# EAGLE schematic DigitalSandbox (EAGLE 6.5.0)
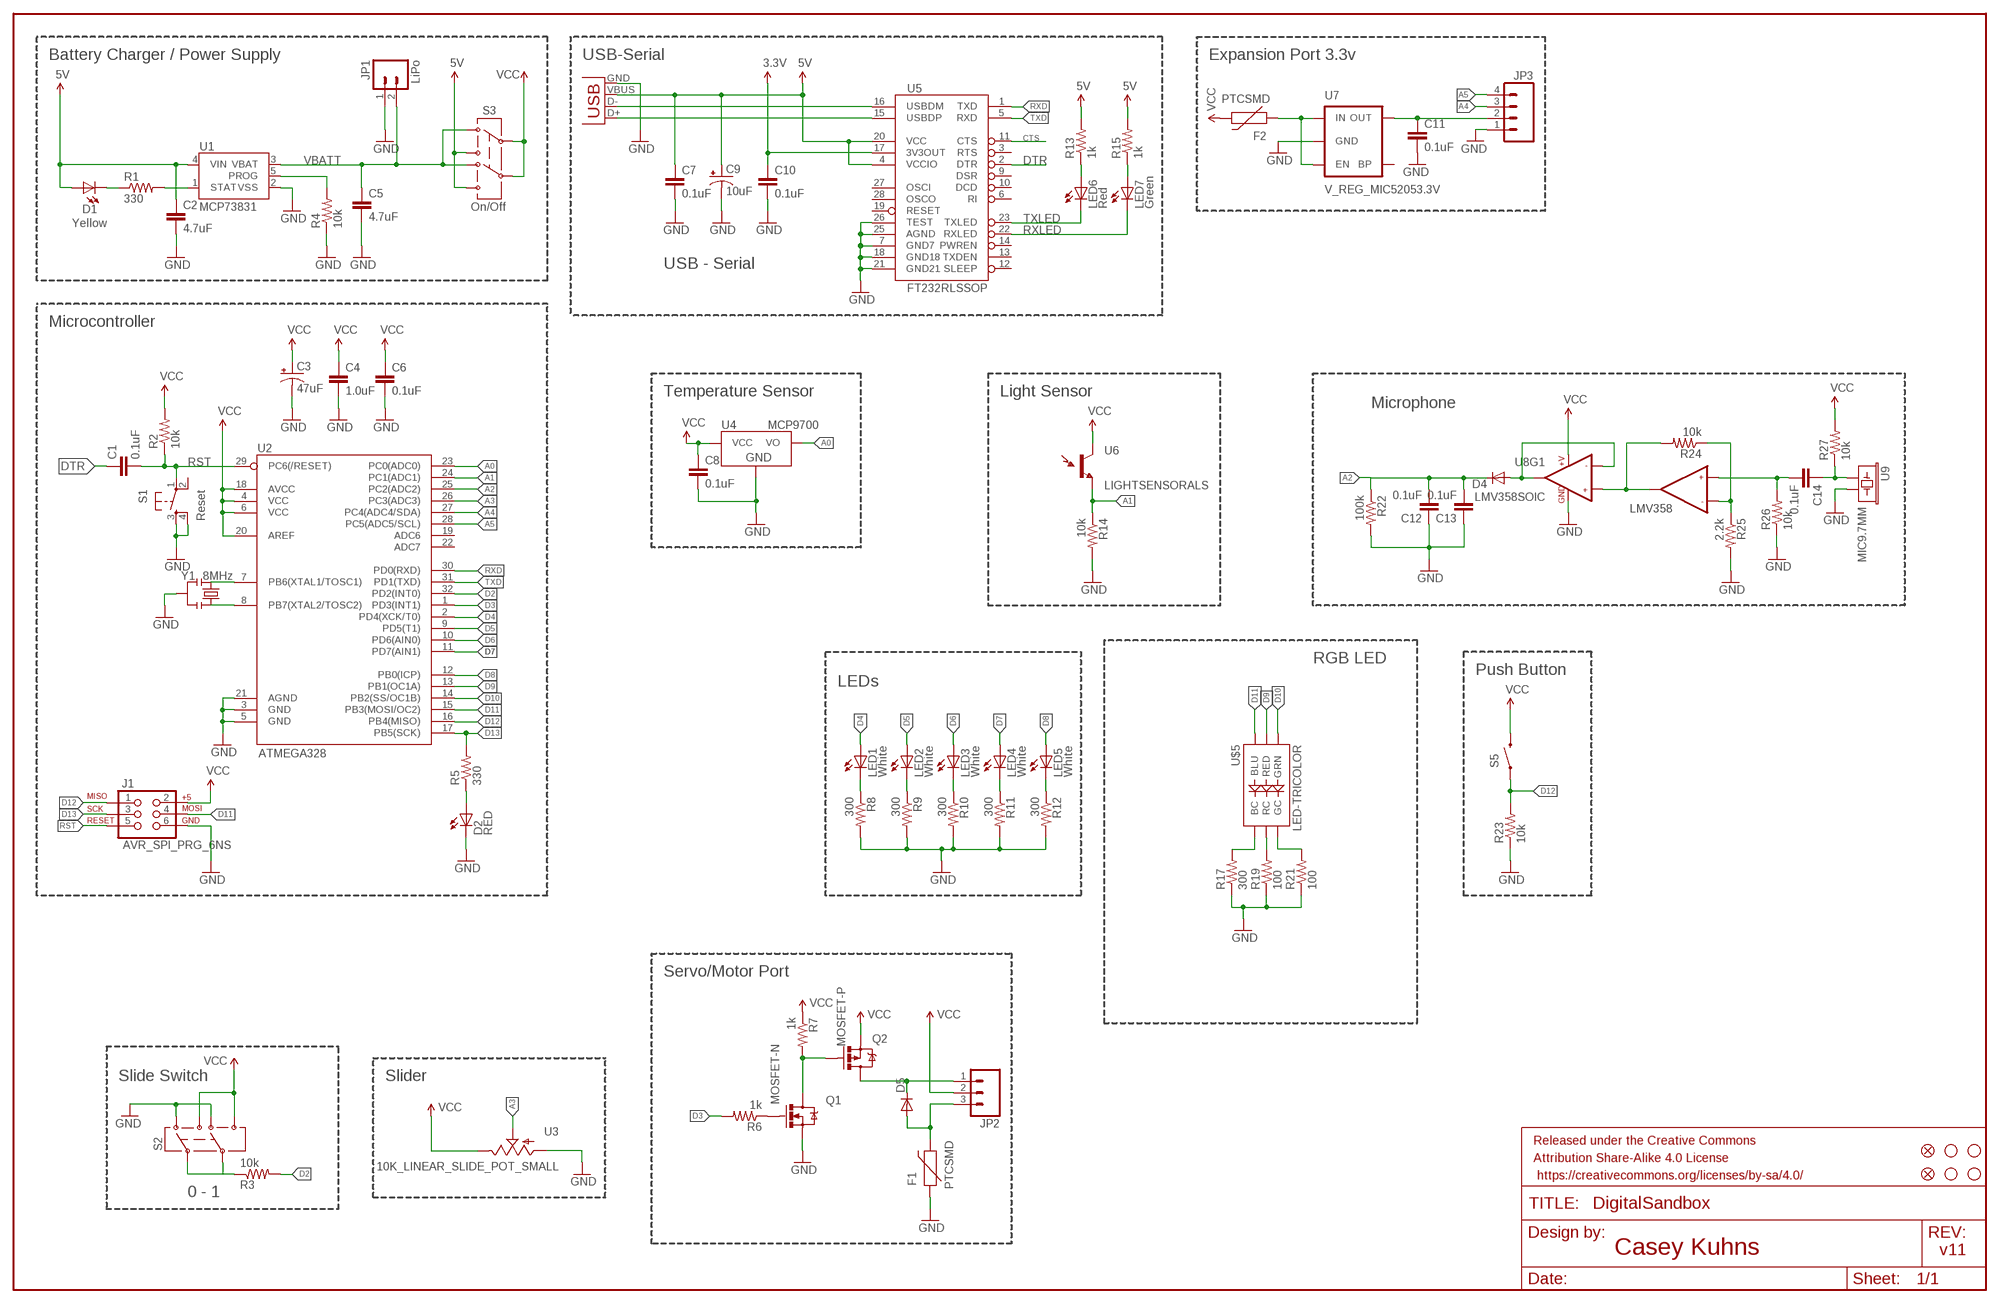
[diagram p0: schematic, sheet 1]

## Parts
C1  0.1uF  0.1UF-25V(+80/-20%)(0603)  [0603-CAP]
C2  4.7uF  4.7UF-6.3V-10%(0603)0603  [0603-CAP]
C3  47uF  47UF-10V-10%(TANT)  [EIA3528]
C4  1.0uF  1.0UF-16V-10%(0603)  [0603-CAP]
C5  4.7uF  4.7UF-6.3V-10%(0603)0603  [0603-CAP]
C6  0.1uF  0.1UF-25V(+80/-20%)(0603)  [0603-CAP]
C7  0.1uF  0.1UF-25V(+80/-20%)(0603)  [0603-CAP]
C8  0.1uF  0.1UF-25V(+80/-20%)(0603)  [0603-CAP]
C9  10uF  10UF-16V-10%(TANT)  [EIA3216]
C10  0.1uF  0.1UF-25V(+80/-20%)(0603)  [0603-CAP]
C11  0.1uF  0.1UF-25V(+80/-20%)(0603)  [0603-CAP]
C12  0.1uF  0.1UF-25V(+80/-20%)(0603)  [0603-CAP]
C13  0.1uF  0.1UF-25V(+80/-20%)(0603)  [0603-CAP]
C14  0.1uF  0.1UF-25V(+80/-20%)(0603)  [0603-CAP]
D1  Yellow  LED-YELLOW0603  [LED-0603]
D2  RED  LED-RED1206  [LED-1206]
D4  DIODESOD  [SOD-323]
D5  DIODESOD  [SOD-323]
F1  PTCSMD  [PTC-1206]
F2  PTCSMD  [PTC-1206]
FID1  FIDUCIAL1X2  [FIDUCIAL-1X2]
FID2  FIDUCIAL1X2  [FIDUCIAL-1X2]
FRAME1  FRAME-LEDGER  [CREATIVE_COMMONS]
J1  AVR_SPI_PRG_6NS  [2X3-NS]
JP1  LiPo  M02-JST-2MM-SMT  [JST-2-SMD]
JP2  M03SMD_RA_FEMALE  [1X03_SMD_RA_FEMALE]
JP3  M04SMD_STRAIGHT_COMBO  [1X04_SMD_STRAIGHT_COMBO]
LED1  White  LED-WHITE  [LED-1206]
LED2  White  LED-WHITE  [LED-1206]
LED3  White  LED-WHITE  [LED-1206]
LED4  White  LED-WHITE  [LED-1206]
LED5  White  LED-WHITE  [LED-1206]
LED6  Red  LED-RED0603  [LED-0603]
LED7  Green  LED-GREEN0603  [LED-0603]
Q1  MOSFET-N  MOSFET-NCHANNELBSS138  [SOT23]
Q2  MOSFET-P  MOSFET-PCHANNEL  [SOT23-3]
R1  330  330OHM1/10W1%(0603)  [0603-RES]
R2  10k  10KOHM1/10W1%(0603)0603  [0603-RES]
R3  10k  10KOHM1/10W1%(0603)0603  [0603-RES]
R4  10k  10KOHM1/10W1%(0603)0603  [0603-RES]
R5  330  330OHM1/10W1%(0603)  [0603-RES]
R6  1k  1KOHM1/10W1%(0603)  [0603-RES]
R7  1k  1KOHM1/10W1%(0603)  [0603-RES]
R8  300  300OHM-1/10W-1%(0603)  [0603-RES]
R9  300  300OHM-1/10W-1%(0603)  [0603-RES]
R10  300  300OHM-1/10W-1%(0603)  [0603-RES]
R11  300  300OHM-1/10W-1%(0603)  [0603-RES]
R12  300  300OHM-1/10W-1%(0603)  [0603-RES]
R13  1k  1KOHM1/10W1%(0603)  [0603-RES]
R14  10k  10KOHM1/10W1%(0603)0603  [0603-RES]
R15  1k  1KOHM1/10W1%(0603)  [0603-RES]
R17  300  300OHM-1/10W-1%(0603)  [0603-RES]
R19  100  100OHM1/10W1%(0603)  [0603-RES]
R21  100  100OHM1/10W1%(0603)  [0603-RES]
R22  100k  100KOHM1/10W1%(0603)  [0603-RES]
R23  10k  10KOHM1/10W1%(0603)0603  [0603-RES]
R24  10k  10KOHM1/10W1%(0603)0603  [0603-RES]
R25  2.2k  2.2KOHM1/10W1%(0603)  [0603-RES]
R26  10k  10KOHM1/10W1%(0603)0603  [0603-RES]
R27  10k  10KOHM1/10W1%(0603)0603  [0603-RES]
S1  Reset  TAC_SWITCHSMD  [TACTILE_SWITCH_SMD]
S2  SWITCH-DPDTAYZ0202  [AYZ0202]
S3  On/Off  SWITCH-DPDTAYZ0202  [AYZ0202]
S5  SWITCH-MOMENTARY-2SMD-4  [TACTILE_SWITCH_TALL]
STANDOFF1  STAND-OFF  [STAND-OFF]
STANDOFF2  STAND-OFF  [STAND-OFF]
STANDOFF3  STAND-OFF  [STAND-OFF]
STANDOFF4  STAND-OFF  [STAND-OFF]
U1  MCP73831  [SOT23-5]
U2  ATMEGA328  ATMEGA328_SMT  [TQFP32-08]
U3  10K_LINEAR_SLIDE_POT_SMALL  [C2031N-1A2-B10K-GP]
U4  MCP9700  MCP9700SMD  [SOT23-3]
U5  FT232RLSSOP  [SSOP28DB]
U6  LIGHTSENSORALS  [ALS-PT19]
U7  V_REG_MIC52053.3V  [SOT23-5]
U8  LMV358SOIC  [SO08]
U9  MIC9.7MM  [MIC-9.7MM]
U$5  LED-TRICOLOR  LED-TRICOLOR-NO-COMPLCC-6-SMD  [PLCC-6-LED]
X1  USBSMD  [USB-MINIB]
Y1  8MHz  RESONATOR8MHZ  [RESONATOR-SMD]

## Nets
3.3V [power]: C10.1 U5.17(3V3OUT)
5V: C2.1 C7.1 C9.A(+) D1.A R13.2 R15.2 S3.3 S3.6 U1.4(VIN) U5.4(VCCIO) U5.20(VCC) X1.VBUS
A0: U2.23(PC0(ADC0)) U4.2(VO)
A1: R14.1 U2.24(PC1(ADC1)) U6.E(E1)
A2: C12.2 C13.2 D4.C R22.1 U2.25(PC2(ADC2))
A3: U2.26(PC3(ADC3)) U3.1(S)
A4: JP3.3 U2.27(PC4(ADC4/SDA))
A5: JP3.4 U2.28(PC5(ADC5/SCL))
BLUE: R17.2 U$5.CB(BC)
CTS: U5.11(CTS)
D2: R3.2 U2.32(PD2(INT0))
D3: R6.2 U2.1(PD3(INT1))
D4: LED1.A U2.2(PD4(XCK/T0))
D5: LED2.A U2.9(PD5(T1))
D6: LED3.A U2.10(PD6(AIN0))
D7: LED4.A U2.11(PD7(AIN1))
D8: LED5.A U2.12(PB0(ICP))
D9: U2.13(PB1(OC1A)) U$5.AR(RED)
D10: U2.14(PB2(SS/OC1B)) U$5.AG(GRN)
D11: J1.4 U2.15(PB3(MOSI/OC2)) U$5.AB(BLU)
D12: J1.1 R23.2 S5.A2 U2.16(PB4(MISO))
D13: J1.3 R5.2 U2.17(PB5(SCK))
DTR: C1.1 U5.2(DTR)
GND [power]: C2.2 C3.C(-) C4.2 C5.2 C6.2 C7.2 C8.2 C9.C(-) C10.2 C11.2 C12.1 C13.1 D2.C F1.1 J1.6 JP1.1 JP3.1 Q1.2(S) R4.1 R8.2 R9.2 R10.2 R11.2 R12.2 R14.2 R17.1 R19.1 R21.1 R22.2 R23.1 R25.2 R26.1 S1.3 S1.4 S2.1 S2.4 U1.2(VSS) U2.3(GND) U2.5(GND) U2.21(AGND) U3.2(A) U4.3(GND) U5.7(GND7) U5.18(GND18) U5.21(GND21) U5.25(AGND) U5.26(TEST) U7.2(GND) U8.4(GND) U9.2 X1.GND Y1.2
GRN: R21.2 U$5.CG(GC)
N$1: U2.7(PB6(XTAL1/TOSC1)) Y1.1
N$2: D2.A R5.1
N$3: U2.8(PB7(XTAL2/TOSC2)) Y1.3
N$4: Q1.3(D) Q2.1(G) R7.2
N$5: LED6.A R13.1
N$6: LED7.A R15.1
N$7 [power]: F2.1 U7.1(IN) U7.3(EN)
N$8: D5.C JP2.1 Q2.3(D)
N$9: LED3.C R10.1
N$10: Q1.1(G) R6.1
N$11: LED4.C R11.1
N$12: C11.1 JP3.2 U7.5(OUT)
N$13: LED5.C R12.1
N$15: R3.1 S2.2 S2.5
N$16 [power]: D5.A F1.2 JP2.3
N$17: C14.1 R27.1 U9.1
N$18: LED1.C R8.1
N$20: C14.2 R26.2 U8.5(+IN2)
N$21: LED2.C R9.1
N$23: R24.1 R25.1 U8.6(-IN2)
N$24: D4.A U8.1(OUT1) U8.2(-IN1)
N$26: R24.2 U8.3(+IN1) U8.7(OUT2)
N$33: D1.C R1.1
PROG: R4.2 U1.5(PROG)
RED: R19.2 U$5.CR(RC)
RST: C1.2 J1.5 R2.1 S1.1 U2.29(PC6(/RESET))
RXD: U2.30(PD0(RXD)) U5.1(TXD)
RXLED: LED7.C U5.22(RXLED)
STAT: R1.2 U1.1(STAT)
TXD: U2.31(PD1(TXD)) U5.5(RXD)
TXLED: LED6.C U5.23(TXLED)
USB_D+: U5.15(USBDP) X1.D+
USB_D-: U5.16(USBDM) X1.D-
VBATT: C5.1 JP1.2 S3.1 S3.4 U1.3(VBAT)
VCC [power]: C3.A(+) C4.1 C6.1 C8.1 F2.2 J1.2 JP2.2 Q2.2(S) R2.2 R7.1 R27.2 S2.3 S2.6 S3.2 S3.5 S5.B2 U2.4(VCC) U2.6(VCC) U2.18(AVCC) U2.20(AREF) U3.3(E) U4.1(VCC) U6.C(C1) U8.8(+V)
Unconnected: S1.2 U2.19(ADC6) U2.22(ADC7) U5.3(RTS) U5.6(RI) U5.9(DSR) U5.10(DCD) U5.12(SLEEP) U5.13(TXDEN) U5.14(PWREN) U5.19(RESET) U5.27(OSCI) U5.28(OSCO) U7.4(BP)

## Notes on the sheet
- Battery Charger / Power Supply | USB-Serial | Expansion Port 3.3v
- USB - Serial
- Microcontroller
- Temperature Sensor | Light Sensor
- Microphone
- LMV358
- RGB LED
- Push Button
- LEDs
- Servo/Motor Port
- Slide Switch | Slider
- 0 - 1
- Casey Kuhns | v11

## Library data of the parts
C1 C6-C8 C10-C14 = SparkFun-Capacitors:0.1UF-25V(+80/-20%)(0603): CAP-00810 Ceramic Standard decoupling cap; PROD_ID: CAP-00810
C2 C5 = SparkFun-Capacitors:4.7UF-6.3V-10%(0603): CAP-08280; PROD_ID: CAP-08280
C3 = SparkFun-Capacitors:47UF-10V-10%(TANT): CAP-08310 47uF Tantalum SMT 10V 10% (EIA-3528); PROD_ID: CAP-08310
C4 = SparkFun-Capacitors:1.0UF-16V-10%(0603): CAP-00868; PROD_ID: CAP-00868
C9 = SparkFun-Capacitors:10UF-16V-10%(TANT): CAP-00811 1206/EIA-3216 Tantalum capacitor; PROD_ID: CAP-00811
D1 = SparkFun-LED:LED-YELLOW: Yellow SMD LEDs LilyPad 1206- DIO-09909 0603- DIO-09003; PROD_ID: DIO-09003
D2 = SparkFun-LED:LED-RED: Assorted Red LEDs LilyPad 1206- DIO-09912 1206- DIO-00809 0603- DIO-00819; PROD_ID: DIO-00809
D4 D5 = SparkFun-DiscreteSemi:DIODE: Diode These are standard reverse protection diodes and small signal diodes. SMA package can handle up to about 1A. SOD-323 can handle about 200mA. What the SOD-323 package when ordering, there are some mfgs out there that are 5-pin packages.; PROD_ID: DIO-09646
F1 F2 = SparkFun-PowerIC:PTC: Resettable Fuse PTC Resettable Fuse. Spark Fun Electronics SKU : COM-08357; PROD_ID: RES-11150
FID1 FID2 = SparkFun-Aesthetics:FIDUCIAL: Fiducial Alignment Points Various fiducial points for machine vision alignment.
FRAME1 = SparkFun-Aesthetics:FRAME-LEDGER: Schematic Frame Standard 11x14 US Ledger frame
J1 = SparkFun-Connectors:AVR_SPI_PRG_6: AVR ISP 6 Pin This is the reduced ISP connector for AVR programming. Common on Arduino. This footprint will take up less PCB space and can be used with a 10-pin to 6-pin adapter such as SKU: BOB-08508
JP1 = SparkFun-Connectors:M02: Standard 2-pin 0.1" header. Use with - straight break away headers ( PRT-00116) - right angle break away headers (PRT-00553) - swiss pins (PRT-00743) - machine pins (PRT-00117) - female headers (PRT-00115) Molex polarized connector foot print use with: PRT-08233 with associated crimp pins and housings. 2.54_SCREWTERM for use with PRT-10571. 3.5mm Screw Terminal footprints for PRT-08084 5mm Screw Terminal footprints for use with PRT-08433; PROD_ID: CONN-08352
JP2 = SparkFun-Connectors:M03: Header 3 Standard 3-pin 0.1" header. Use with straight break away headers (SKU : PRT-00116), right angle break away headers (PRT-00553), swiss pins (PRT-00743), machine pins (PRT-00117), and female headers (PRT-00115). Molex polarized connector foot print use with SKU : PRT-08232 with associated crimp pins and housings.; PROD_ID: CONN-10926; VALUE: 1x3 RA Female .1"
JP3 = SparkFun-Connectors:M04: Header 4 Standard 4-pin 0.1" header. Use with straight break away headers (SKU : PRT-00116), right angle break away headers (PRT-00553), swiss pins (PRT-00743), machine pins (PRT-00117), and female headers (PRT-00115). Molex polarized connector foot print use with SKU : PRT-08231 with associated crimp pins and housings. 1MM SMD Version SKU: PRT-10208
LED1-LED5 = SparkFun-LED:LED-WHITE: White SMD LEDs LilyPad 1206- DIO-09955; PROD_ID: DIO-09955; VALUE: WHITE
LED6 = SparkFun-LED:LED-RED: Assorted Red LEDs LilyPad 1206- DIO-09912 1206- DIO-00809 0603- DIO-00819; PROD_ID: DIO-00819; VALUE: RED
LED7 = SparkFun-LED:LED-GREEN: Various green LEDs Green LEDs used in SFE Production 0603- DIO-00821 LARGE- DIO-00862 LILYPAD- DIO-09910; PROD_ID: DIO-00821; VALUE: GREEN
Q1 = SparkFun-DiscreteSemi:MOSFET-NCHANNEL: Common NMOSFET Parts MFG P/N Store ID Prod ID FDD8780 TRANS-09984 SI7820DN TRANS-11055 FDS6630A IC-08089 2N7002PW TRANS-11151 FQP30N06L COM-10213 TRANS-10060 BSS123LT1G TRANS-08345 BSS138 TRANS-00830 BS170 2N7000; PROD_ID: TRANS-00830
Q2 = SparkFun-DiscreteSemi:MOSFET-PCHANNEL: Generic PMOSFET; PROD_ID: TRANS-08285
R1 R5 = SparkFun-Resistors:330OHM1/10W1%(0603): RES-00818; PROD_ID: RES-00818
R2-R4 R14 R23 R24 R26 R27 = SparkFun-Resistors:10KOHM1/10W1%(0603): RES-00824; PROD_ID: RES-00824; VALUE: 10K
R6 R7 R13 R15 = SparkFun-Resistors:1KOHM1/10W1%(0603): RES-07856; PROD_ID: RES-07856; VALUE: 1K
R8-R12 R17 = SparkFun-Resistors:300OHM-1/10W-1%(0603): RES-10328; PROD_ID: RES_10328
R19 R21 = SparkFun-Resistors:100OHM1/10W1%(0603): RES-07863; PROD_ID: RES-07863
R22 = SparkFun-Resistors:100KOHM1/10W1%(0603): RES-07828; PROD_ID: RES-07828
R25 = SparkFun-Resistors:2.2KOHM1/10W1%(0603): RES-08272; PROD_ID: RES-08272
S1 = SparkFun-Electromechanical:TAC_SWITCH: Momentary Switch Button commonly used for reset or general input. Spark Fun Electronics SKU : COM-00097 SMT- SWCH-08247; PROD_ID: SWCH-08247
S2 S3 = SparkFun-Electromechanical:SWITCH-DPDT: DPDT Version of the COM-00597; PROD_ID: SWCH-08179; VALUE: DPDT
S5 = SparkFun-Electromechanical:SWITCH-MOMENTARY-2: Various NO switches- pushbuttons, reed, etc; PROD_ID: SWCH-11966
STANDOFF1-STANDOFF4 = SparkFun-Electromechanical:STAND-OFF: #4 Stand Off This is the mechanical footprint for a #4 phillips button head screw. Use the keepout ring to avoid running the screw head into surrounding components. SKU : PRT-00447
U1 = SparkFun-PowerIC:MCP73831: Miniature single cell, fully integrated Li-Ion, Li-polymer charge management controller http://ww1.microchip.com/downloads/en/DeviceDoc/21984a.pdf IC-09995; PROD_ID: IC-09995
U2 = SparkFun-DigitalIC:ATMEGA328_SMT: 32-Pin Atmega328 part Commonly used on Arduino compatible boards Available in QFP and QFN packages TQFP is IC-09069 QFN is non-stock; PROD_ID: IC-09069; VALUE: ATMEGA328P
U3 = SparkFun-Resistors:10K_LINEAR_SLIDE_POT_SMALL; PROD_ID: RES-11924
U4 = SparkFun-Sensors:MCP9700: Analog-output temperature sensor; PROD_ID: IC-08917
U5 = SparkFun-DigitalIC:FT232RL: USB UART FT232RL 4th Generation USB UART (USB <-> Serial) Controller. Spark Fun Electronics SKU : COM-00650 Production SKU IC-00870; PROD_ID: IC-00870
U6 = SparkFun-Sensors:LIGHTSENSOR: Ambient Light Sensor Simple light detection sensor. Output varies with light intensity input. Spark Fun Electronics SKU : COM-08348; PROD_ID: IC-11836
U7 = SparkFun-PowerIC:V_REG_MIC5205: V_REG MIC5219 Standard 3.3V and 5V 150mA LDO voltage regulator in SOT-23 layout. Micrel part MIC5205. BP (by-pass) pin is used to lower output noise with 470pF cap, may be left open.; PROD_ID: VREG-00822; VALUE: 3.3V/150mA
U8 = SparkFun-AnalogIC:LMV358: Jellybean rail-to-rail output op-amp; PROD_ID: IC-09657
U9 = SparkFun-Sensors:MIC: Omni-directional electret microphone. 9.7mm standard diameter.; PROD_ID: COMP-08856
U$5 = SparkFun-LED:LED-TRICOLOR-NO-COM; PROD_ID: DIO-12113
X1 = SparkFun-Connectors:USB: USB Connectors USB-B-PTH is fully proven SKU : PRT-00139/CONN-08278 USB-miniB is fully proven SKU : PRT-00587 USB-A-PCB is untested. USB-A-H is throughly reviewed, but untested. Spark Fun Electronics SKU : PRT-00437 USB-B-SMT is throughly reviewed, but untested. Needs silkscreen touching up. USB-A-S has not been used/tested USB-MB-H has not been used/tested USB-MICROB has been used. CONN-09505; PROD_ID: CONN-08193
Y1 = SparkFun-FreqCtrl:RESONATOR: Resonator Small SMD resonator. Used, eg, on the Arduino Pro/ Pro Mini boards. 8MHz- XTAL-08895 16MHz- XTAL-08900; PROD_ID: XTAL-08895; VALUE: 8MHZ

## Net classes
0 default: width 0.203 mm
1 power: width 0.254 mm